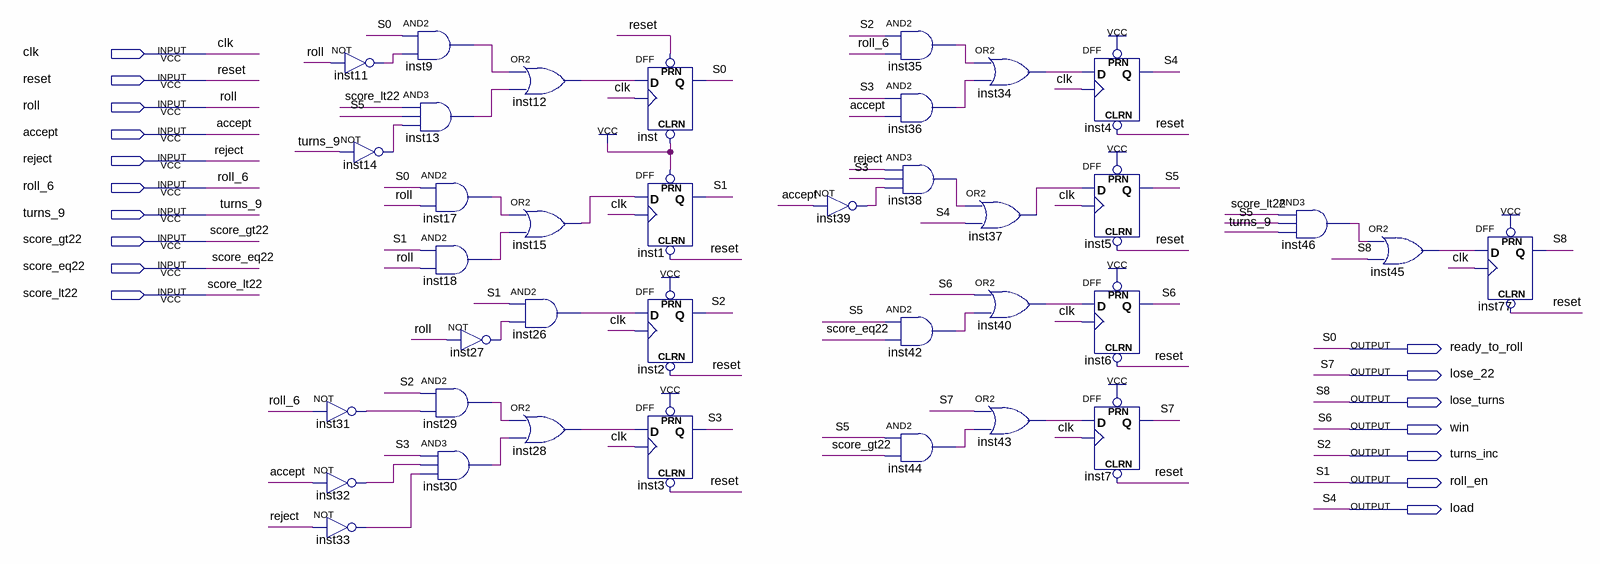
[diagram p0: schematic sheet]
// Quartus schematic control2.bdf as structural Verilog: 37 symbols, 17 pins
module control2 (
  input  clk,
  input  reset,
  input  roll,
  input  accept,
  input  reject,
  input  roll_6,
  input  turns_9,
  input  score_gt22,
  input  score_eq22,
  input  score_lt22,
  output ready_to_roll,
  output lose_22,
  output lose_turns,
  output win,
  output turns_inc,
  output roll_en,
  output load
);

  wire inst9_out, inst11_out, inst12_out, inst13_out, inst14_out, inst15_out, inst17_out, inst18_out,
       inst26_out, inst27_out, inst28_out, inst29_out, inst30_out, inst31_out, inst32_out, inst33_out,
       inst34_out, inst35_out, inst36_out, inst37_out, inst38_out, inst39_out, inst40_out, inst42_out,
       inst43_out, inst44_out, inst45_out, inst46_out, S3, S5;

  not inst11 (inst11_out, roll);
  not inst14 (inst14_out, turns_9);
  not inst31 (inst31_out, roll_6);
  not inst32 (inst32_out, accept);
  not inst33 (inst33_out, reject);
  and inst9 (inst9_out, ready_to_roll, inst11_out);
  and inst13 (inst13_out, score_lt22, S5, inst14_out);
  and inst17 (inst17_out, ready_to_roll, roll);
  and inst18 (inst18_out, roll_en, roll);
  and inst29 (inst29_out, turns_inc, inst31_out);
  and inst30 (inst30_out, S3, inst32_out, inst33_out);
  or inst12 (inst12_out, inst9_out, inst13_out);
  or inst15 (inst15_out, inst17_out, inst18_out);
  and inst26 (inst26_out, roll_en, inst27_out);
  not inst27 (inst27_out, roll);
  or inst28 (inst28_out, inst29_out, inst30_out);
  DFF inst (.CLRN(1'b1), .CLK(clk), .D(inst12_out), .PRN(reset), .Q(ready_to_roll));
  DFF inst1 (.CLRN(reset), .CLK(clk), .D(inst15_out), .PRN(1'b1), .Q(roll_en));
  DFF inst2 (.CLRN(reset), .CLK(clk), .D(inst26_out), .PRN(1'b1), .Q(turns_inc));
  DFF inst3 (.CLRN(reset), .CLK(clk), .D(inst28_out), .PRN(1'b1), .Q(S3));
  not inst39 (inst39_out, accept);
  and inst35 (inst35_out, turns_inc, roll_6);
  and inst36 (inst36_out, S3, accept);
  and inst38 (inst38_out, reject, S3, inst39_out);
  and inst42 (inst42_out, S5, score_eq22);
  and inst44 (inst44_out, S5, score_gt22);
  or inst34 (inst34_out, inst35_out, inst36_out);
  or inst37 (inst37_out, inst38_out, load);
  or inst40 (inst40_out, win, inst42_out);
  or inst43 (inst43_out, lose_22, inst44_out);
  DFF inst4 (.CLRN(reset), .CLK(clk), .D(inst34_out), .PRN(1'b1), .Q(load));
  DFF inst5 (.CLRN(reset), .CLK(clk), .D(inst37_out), .PRN(1'b1), .Q(S5));
  DFF inst6 (.CLRN(reset), .CLK(clk), .D(inst40_out), .PRN(1'b1), .Q(win));
  DFF inst7 (.CLRN(reset), .CLK(clk), .D(inst43_out), .PRN(1'b1), .Q(lose_22));
  and inst46 (inst46_out, score_lt22, S5, turns_9);
  or inst45 (inst45_out, inst46_out, lose_turns);
  DFF inst77 (.CLRN(reset), .CLK(clk), .D(inst45_out), .PRN(1'b1), .Q(lose_turns));

  // Other names for the same wires on the sheet: S0 = ready_to_roll; S1 = roll_en; S2 = turns_inc; S4 = load;
  //   S6 = win; S7 = lose_22; S8 = lose_turns
endmodule
